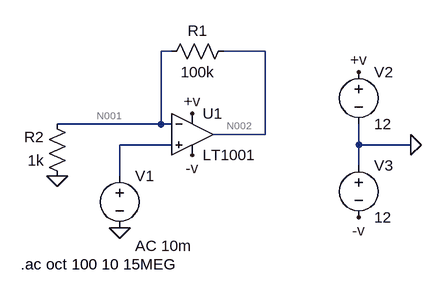
[diagram p0: schematic Draft23.asc]
Draft23.asc, the LTspice schematic file:
Version 4
SHEET 1 880 680
WIRE 112 32 96 32
WIRE 256 32 192 32
WIRE 96 144 96 32
WIRE 96 144 -64 144
WIRE 112 144 96 144
WIRE 256 160 256 32
WIRE 256 160 176 160
WIRE 112 176 32 176
WIRE 400 176 400 144
WIRE 480 176 400 176
WIRE 400 208 400 176
WIRE 32 224 32 176
FLAG 480 176 0
FLAG 32 304 0
FLAG -64 224 0
FLAG 144 128 +v
FLAG 400 64 +v
FLAG 144 192 -v
FLAG 400 288 -v
SYMBOL Opamps\\LT1001 144 96 R0
SYMATTR InstName U1
SYMBOL res 208 16 R90
WINDOW 0 0 56 VBottom 2
WINDOW 3 32 56 VTop 2
SYMATTR InstName R1
SYMATTR Value 100k
SYMBOL res -48 240 R180
WINDOW 0 36 76 Left 2
WINDOW 3 36 40 Left 2
SYMATTR InstName R2
SYMATTR Value 1k
SYMBOL voltage 32 208 R0
WINDOW 123 24 124 Left 2
WINDOW 39 0 0 Left 2
SYMATTR InstName V1
SYMATTR Value ""
SYMATTR Value2 AC 10m
SYMBOL voltage 400 48 R0
SYMATTR InstName V2
SYMATTR Value 12
SYMBOL voltage 400 192 R0
SYMATTR InstName V3
SYMATTR Value 12
TEXT -120 360 Left 2 !.ac oct 100 10 15MEG

The netlist it stands for:
* Draft23.asc
XU1 N003 N001 +v -v N002 LT1001  ; pins In+ In- V+ V- OUT
R1 N002 N001 100k
R2 0 N001 1k
V1 N003 0 AC 10m
V2 +v 0 12
V3 0 -v 12
.ac oct 100 10 15MEG
.lib LTC.lib
.backanno
.end

* Results of the author's LTspice run, read from the files saved beside the schematic
* Operating Point, zero values left out:
*   V(+v) = 12 V
*   V(-v) = -12 V
*   I(V3) = -2.25 mA
*   I(V2) = -2.25 mA
*   Ix(u1:3) = 2.25 mA
*   Ix(u1:4) = -2.25 mA
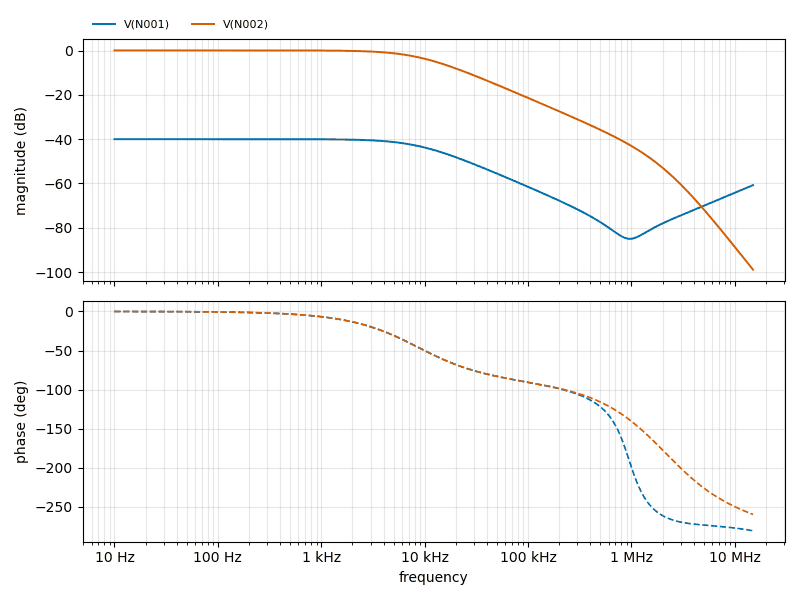
[diagram p1: AC Analysis of Draft23.asc, plotted from the saved traces]
* AC Analysis, 1 run:
*   V(N001): -40.00 dB at 10 Hz, -60.75 dB at 15 MHz, peak -40.00 dB at 10 Hz, 3 dB below the peak at 8.509 kHz
*   V(N002): 0.09 dB at 10 Hz, -98.94 dB at 15 MHz, peak 0.09 dB at 10 Hz, 3 dB below the peak at 8.51 kHz